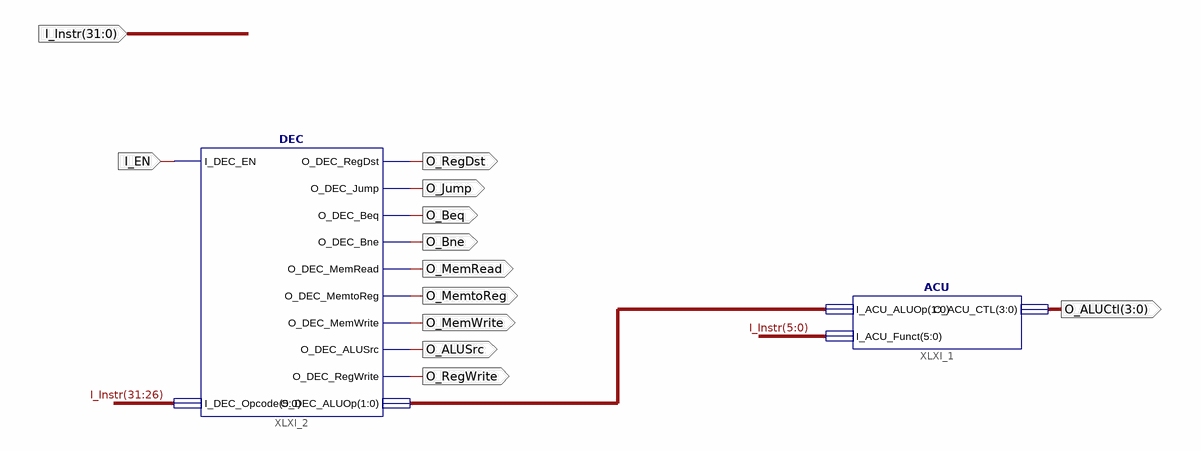
[diagram p0: schematic sheet 1]
// Xilinx ISE schematic Test_Module.sch (spartan3e) as structural Verilog: 2 symbols, 12 ports
module Test_Module (
  input  I_EN,
  input  [31:0] I_Instr,
  output [3:0] O_ALUCtl,
  output O_RegDst,
  output O_Jump,
  output O_Beq,
  output O_Bne,
  output O_MemRead,
  output O_MemtoReg,
  output O_MemWrite,
  output O_ALUSrc,
  output O_RegWrite
);

  wire [1:0] XLXN_4;

  ACU XLXI_1 (.I_ACU_ALUOp(XLXN_4), .I_ACU_Funct(I_Instr[5:0]), .O_ACU_CTL(O_ALUCtl));
  DEC XLXI_2 (
    .I_DEC_EN(I_EN), .I_DEC_Opcode(I_Instr[31:26]), .O_DEC_RegDst(O_RegDst), .O_DEC_Jump(O_Jump),
    .O_DEC_Beq(O_Beq), .O_DEC_Bne(O_Bne), .O_DEC_MemRead(O_MemRead), .O_DEC_MemtoReg(O_MemtoReg),
    .O_DEC_MemWrite(O_MemWrite), .O_DEC_ALUSrc(O_ALUSrc), .O_DEC_RegWrite(O_RegWrite), .O_DEC_ALUOp(XLXN_4));
endmodule
